# Altium schematic sheet Half_bridge_drivers.SchDoc
size B
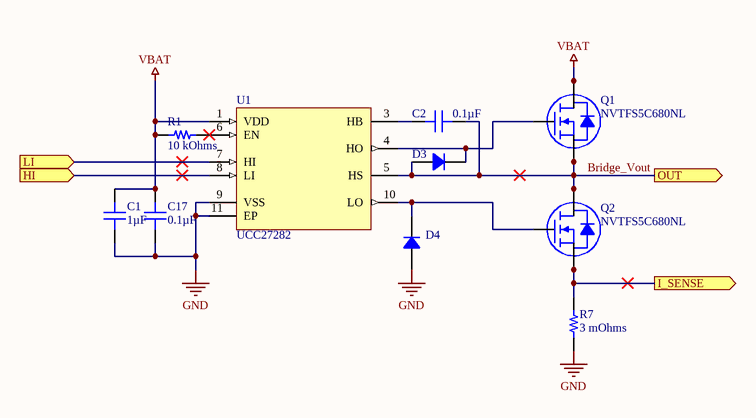
[diagram p0: Half_bridge_drivers.SchDoc]

## Parts
C1  1µF  [CAP 0402_1005]
C2  0.1µF  [CAP 0603_1608]
C17  0.1µF  [CAP 0402_1005]
D3  V1F6-M3/H  [SMF DO-219AB]  (value not drawn)
D4  V1F6-M3/H  [SMF DO-219AB]  (value not drawn)
Q1  NVTFS5C680NL  [NVTFS015N04CTAG]
Q2  NVTFS5C680NL  [NVTFS015N04CTAG]
R1  10 kOhms  [RES 0402_1005]
R7  3 mOhms  [STACKPOLE CSR0603]
U1  UCC27282  [VSON-10]

## Ports
HI (in), I_SENSE (out), LI (in), OUT (out)

## Nets
GND: C1.1 C17.1 D4.1 R7.1 U1.9(VSS) U1.11(EP)
VBAT: C1.2 C17.2 Q1.5(D) Q1.6(D) Q1.7(D) Q1.8(D) R1.1 U1.1(VDD)
Bridge_Vout: C2.1 D3.1 Q1.1(S) Q1.2(S) Q1.3(S) Q2.5(D) Q2.6(D) Q2.7(D) Q2.8(D) U1.5(HS) ; port OUT
HI: U1.8(LI) ; port HI
I_SENSE: Q2.1(S) Q2.2(S) Q2.3(S) R7.2 ; port I_SENSE
LI: U1.7(HI) ; port LI
NetC2_2: C2.2 U1.3(HB)
NetD3_2: D3.2 Q1.4(G) U1.4(HO)
NetD4_2: D4.2 Q2.4(G) U1.10(LO)
NetR1_2: R1.2 U1.6(EN)

## Library data of the parts
C1 = GMK105ABJ105MV-F: CAP CER 1UF 35V X5R 0402; Manufacturer: Taiyo Yuden; Tolerance: ±20%; Part Number: GMK105ABJ105MV-F; Value: 1µF; Applications: SMPS Filtering; Capacitance: 1µF; ComponentLink1Description: Datasheet; ComponentLink1URL: https://ds.yuden.co.jp/TYCOMPAS/ut/detail?pn=GMK105ABJ105MV-F &u=M; ComponentLink2Description: DigiKey Link; ComponentLink2URL: http://digikey.com/product-detail/en/taiyo-yuden/GMK105ABJ105MV-F/587-6270-1-ND/9916391; Device Package: 0402 (1005 Metric); LastUpdated: 02-Sep-20 1:02:25 AM; Lifecycle Status: Active; Minimum Order: 1; Mounting Type: Surface Mount, MLCC; Operating Temperature: -55°C ~ 85°C; Package / Case: 0402 (1005 Metric); Packaging: TapeAndReel; PartId: 1815; Part Status: Active; Price: 0.04; Series: M; Size / Dimension: 0.039" L x 0.020" W (1.00mm x 0.50mm); Supplier 1: DigiKey; Supplier Part Number 1: 587-6270-1-ND; Temperature Coefficient: X5R; Thickness (Max): 0.024" (0.60mm); Voltage - Rated: 35V
C2 = GCG188R92A104KA03D: CAP CER 0.1UF 100V 0603 EPOXY; Manufacturer: Murata Electronics; Temperature Coefficient: X8R; Tolerance: ±10%; Part Number: GCG188R92A104KA03D; Value: 0.1µF; Applications: Automotive; Capacitance: 0.1µF; ComponentLink1Description: Datasheet; ComponentLink1URL: https://search.murata.co.jp/Ceramy/image/img/A01X/G101/ENG/GCG188R92A104KA03-01.pdf; ComponentLink2Description: DigiKey Link; ComponentLink2URL: http://digikey.com/product-detail/en/murata-electronics/GCG188R92A104KA03D/490-18197-1-ND/9867926; Device Package: 0603 (1608 Metric); Features: Epoxy Mountable; LastUpdated: 21-Jan-20 12:01:59 AM; Lifecycle Status: Active; Minimum Order: 1; Mounting Type: Surface Mount, MLCC, Epoxy; Operating Temperature: -55°C ~ 150°C; Package / Case: 0603 (1608 Metric); Packaging: TapeAndReel; PartId: 9025; Part Status: Active; Price: 0.07; Ratings: AEC-Q200; Series: GCG; Size / Dimension: 0.063" L x 0.031" W (1.60mm x 0.80mm); Supplier 1: DigiKey; Supplier Part Number 1: 490-18197-1-ND; Thickness (Max): 0.035" (0.90mm); Voltage - Rated: 100V
C17 = GRM155R71E104KE14J: CAP CER 0.1UF 25V X7R 0402; Manufacturer: Murata Electronics; Tolerance: ±10%; Part Number: GRM155R71E104KE14J; Value: 0.1µF; Applications: General Purpose; Capacitance: 0.1µF; ComponentLink1Description: Datasheet; ComponentLink1URL: https://search.murata.co.jp/Ceramy/image/img/A01X/G101/ENG/GRM155R71E104KE14-01.pdf; ComponentLink2Description: DigiKey Link; ComponentLink2URL: http://digikey.com/product-detail/en/murata-electronics/GRM155R71E104KE14J/490-14603-1-ND/6606209; Device Package: 0402 (1005 Metric); LastUpdated: 02-Sep-20 1:02:19 AM; Lifecycle Status: Active; Minimum Order: 1; Mounting Type: Surface Mount, MLCC; Operating Temperature: -55°C ~ 125°C; Package / Case: 0402 (1005 Metric); Packaging: CutTape; PartId: 3958; Part Status: Active; Price: 0.10; Series: GRM; Size / Dimension: 0.039" L x 0.020" W (1.00mm x 0.50mm); Supplier 1: DigiKey; Supplier Part Number 1: 490-14603-1-ND; Temperature Coefficient: X7R; Thickness (Max): 0.022" (0.55mm); Voltage - Rated: 25V
D3 D4 = V1F6-M3/H: 1A 60V SMF TRENCH SKY RECT; Manufacturer: Vishay Semiconductor Diodes Division; Capacitance @ Vr, F: 135pF @ 4V, 1MHz; Current - Reverse Leakage @ Vr: 270µA @ 60V; Diode Type: Schottky; Speed: Fast Recovery =< 500ns, > 200mA (Io); Voltage - Forward (Vf) (Max) @ If: 600mV @ 1A; Part Number: V1F6-M3/H; ComponentLink1Description: Datasheet; ComponentLink1URL: http://www.vishay.com/docs/87555/v1f6.pdf; ComponentLink2Description: DigiKey Link; ComponentLink2URL: http://digikey.com/product-detail/en/vishay-semiconductor-diodes-division/V1F6-M3-H/112-V1F6-M3-HCT-ND/10660586; Current - Average Rectified (Io): 1A; LastUpdated: 02-Sep-20 1:23:13 AM; Lifecycle Status: Active; Minimum Order: 1; Mounting Type: Surface Mount; Operating Temperature - Junction: -40°C ~ 150°C; Package / Case: DO-219AB; Packaging: Unknown; PartId: 3272; Part Status: Active; Price: 0.07; Series: eSMP®, TMBS®; Supplier 1: DigiKey; Supplier Part Number 1: 112-V1F6-M3/HCT-ND; Supplier Device Package: DO-219AB (SMF); Voltage - DC Reverse (Vr) (Max): 60V
R1 = RMCF0402FT10K0: RES 10K OHM 1% 1/16W 0402; Manufacturer: Stackpole Electronics Inc; Power (Watts): 0.063W, 1/16W; Temperature Coefficient: ±100ppm/°C; Part Number: RMCF0402FT10K0; Value: 10 kOhms; ComponentLink1Description: Datasheet; ComponentLink1URL: https://www.seielect.com/catalog/sei-rmcf_rmcp.pdf; ComponentLink2Description: DigiKey Link; ComponentLink2URL: http://digikey.com/product-detail/en/stackpole-electronics-inc/RMCF0402FT10K0/RMCF0402FT10K0CT-ND/1942925; Composition: Thick Film; Device Package: 0402 (1005 Metric); Features: Automotive AEC-Q200; Height - Seated (Max): 0.016" (0.40mm); LastUpdated: 02-Sep-20 1:07:28 AM; Lifecycle Status: Active; Minimum Order: 1; Number of Terminations: 2; Operating Temperature: -55°C ~ 155°C; Package / Case: 0402 (1005 Metric); Packaging: CutTape; PartId: 20541; Part Status: Active; Price: 0.10; Ratings: AEC-Q200; Resistance: 10 kOhms; Series: RMCF; Size / Dimension: 0.039" L x 0.020" W (1.00mm x 0.50mm); Supplier 1: DigiKey; Supplier Part Number 1: RMCF0402FT10K0CT-ND; Supplier Device Package: 0402; Tolerance: ±1%
R7 = CSS0603FT3L00: RES SHUNT, 0603, 0.003 OHM, 1%,; Manufacturer: Stackpole Electronics Inc; Power (Watts): 0.333W, 1/3W; Temperature Coefficient: ±100ppm/°C; Part Number: CSS0603FT3L00; ComponentLink2Description: DigiKey Link; ComponentLink2URL: http://digikey.com/product-detail/en/stackpole-electronics-inc/CSS0603FT3L00/738-CSS0603FT3L00CT-ND/10719388; Composition: Metal Element; Device Package: 0603 (1608 Metric); Features: Automotive AEC-Q200, Current Sense; Height - Seated (Max): 0.026" (0.65mm); LastUpdated: 19-Jul-20 11:45:32 PM; Lifecycle Status: Active; Minimum Order: 1; Number of Terminations: 2; Operating Temperature: -55°C ~ 155°C; Packaging: TapeAndReel; PartId: 1932; Part Status: Active; Price: 0.10; Ratings: AEC-Q200; Resistance: 3 mOhms; Series: CSS; Size / Dimension: 0.063" L x 0.031" W (1.60mm x 0.80mm); Supplier 1: DigiKey; Supplier Part Number 1: 738-CSS0603FT3L00CT-ND; Supplier Device Package: 0603; Tolerance: ±1%; Value: 3 mOhms
U1 = UCC27282DRCR: 3-A, 120-V half bridge gate driver with 5-V UVLO, interlock and enable 10-VSON -40 to 125; MF: Texas Instruments; Texas_Instruments-Purchase-URL: https://snapeda.com/shop?store=Texas+Instruments&id=3625400; Price: None; Availability: Warning; Package: VSON-10 Texas Instruments; SnapEDA_Link: https://www.snapeda.com/parts/UCC27282DRCR/Texas%20Instruments/view-part/3625400/?ref=snap; DigiKey-Purchase-URL: https://snapeda.com/shop?store=DigiKey&id=3625400; MP: UCC27282DRCR; Value: *